# EAGLE design LCD 16x2 + PIN Button (EAGLE 9.5.2)
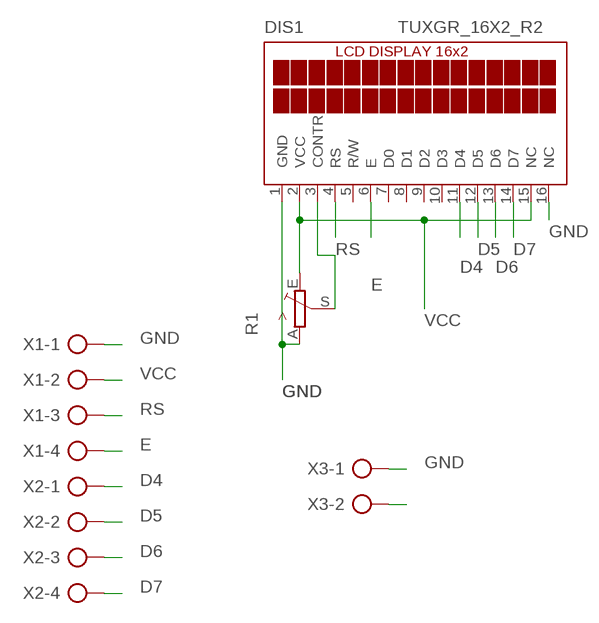
[diagram p0: schematic, sheet 1]

## Parts
DIS1  TUXGR_16X2_R2  [TUXGR_16X2_R2]
R1  TRIM_EU-B25P  [B25P]
X1  AK500/4-H  [AK500/4-H]
X2  AK500/4-H  [AK500/4-H]
X3  AK500/2-H  [AK500/2-H]

## Nets
D4: DIS1.11(D4) X2.1
D5: DIS1.12(D5) X2.2
D6: DIS1.13(D6) X2.3
D7: DIS1.14(D7) X2.4
E: DIS1.6(E) X1.4
GND: DIS1.1(GND) DIS1.16(NC) R1.A X1.1 X3.1
N$1: DIS1.3(CONTR) R1.S
N$3: X3.2
RS: DIS1.4(RS) X1.3
VCC: DIS1.2(VCC) DIS1.15(NC) R1.E X1.2
Unconnected: DIS1.5(R/W) DIS1.7(D0) DIS1.8(D1) DIS1.9(D2) DIS1.10(D3)

## Library data of the parts
DIS1 = display-lcd:TUXGR_16X2_R2: Tuxgraphics LCD display 16x2 characters reflective, without background light Source: tuxgr_12x2_r2.pdf; OC_FARNELL: unknown; OC_NEWARK: unknown
R1 = pot:TRIM_EU-: POTENTIOMETER
X1 X2 = con-ptr500:AK500/4-H: CONNECTOR Aug. 2004 / PTR Meßtechnik: Die Bezeichnung der Serie AK505 wurde geändert. Es handelt sich hierbei um AK500 in horizontaler Ausführung.; OC_FARNELL: unknown; OC_NEWARK: unknown
X3 = con-ptr500:AK500/2-H: CONNECTOR Aug. 2004 / PTR Meßtechnik: Die Bezeichnung der Serie AK505 wurde geändert. Es handelt sich hierbei um AK500 in horizontaler Ausführung.; OC_FARNELL: unknown; OC_NEWARK: unknown

## Board
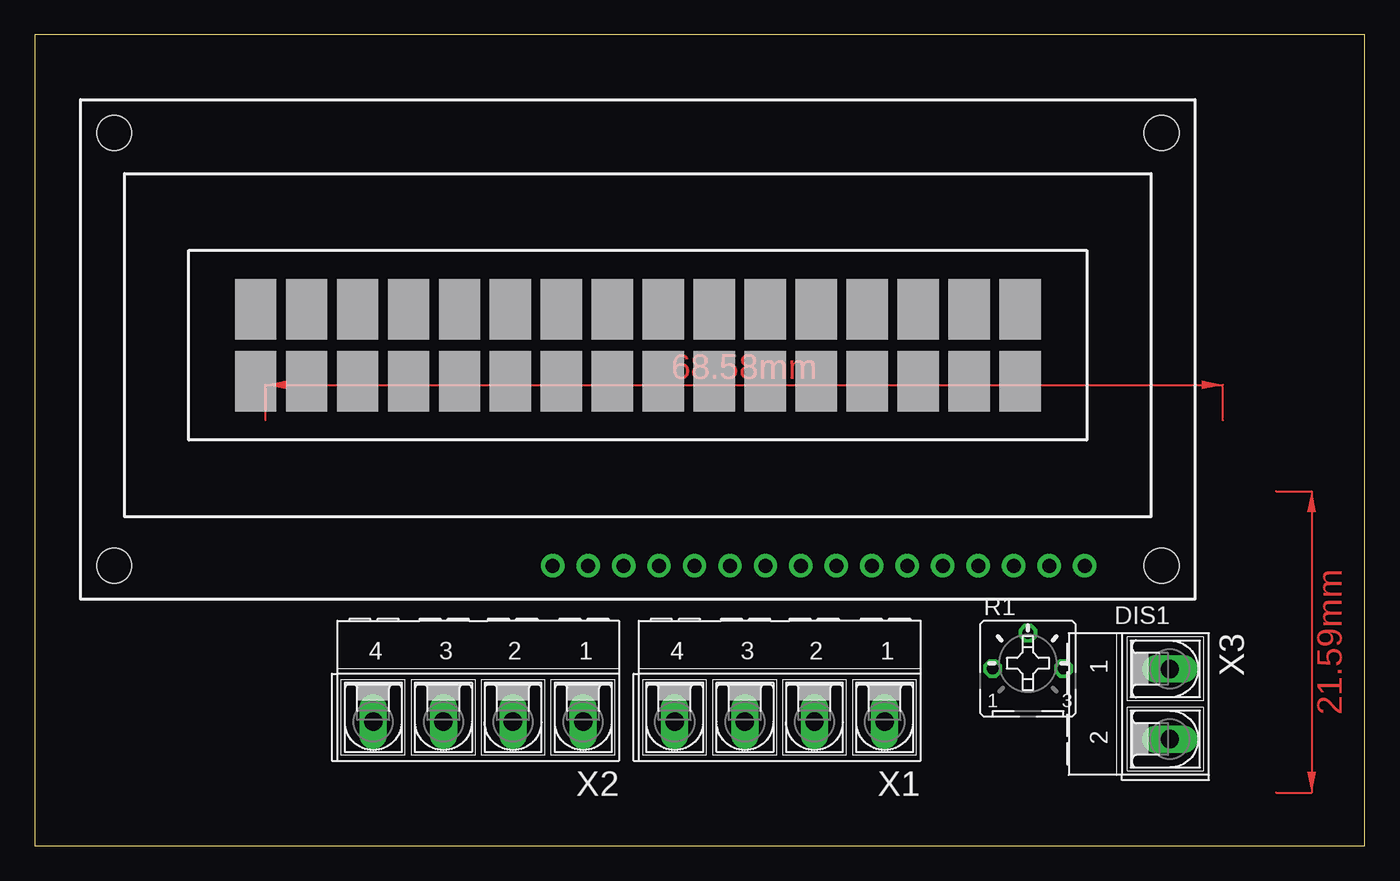
[diagram p1: board, top side]
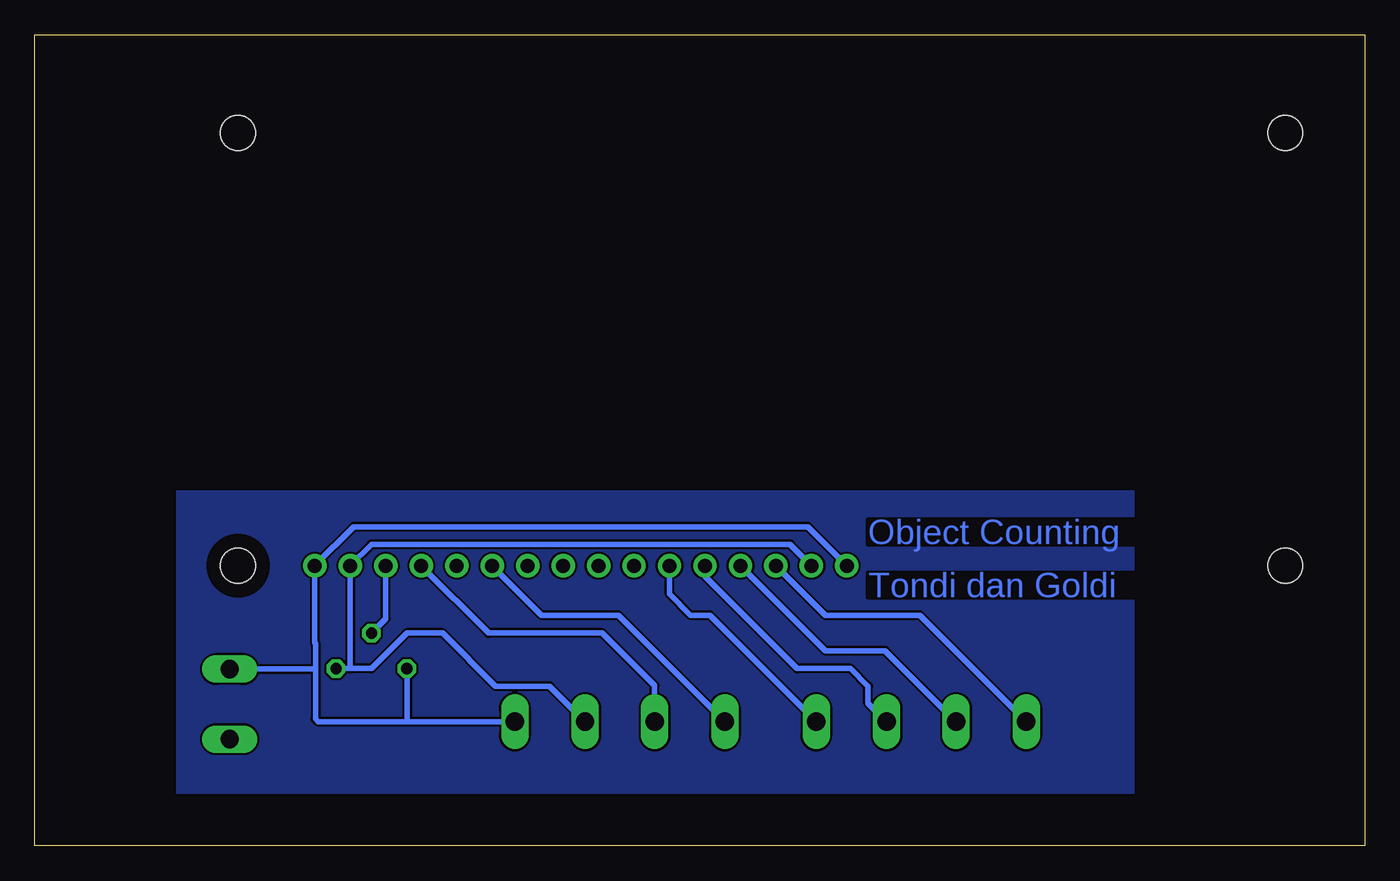
[diagram p2: board, bottom side, seen from below]

Size 95.23 x 58.09 mm. Coordinates in mm from the lower left corner, seen from the top.
Outline: 0,0 95.23,0 95.23,58.09 0,58.09 0,0
Copper layers (1*16): Top 0.035mm / dielectric 1.5mm / Bottom 0.035mm
Design rules "default": minimum track width 6mil, minimum drill 0.35mm, track to track 6mil, track to pad 6mil, pad to pad 6mil, via to via 6mil, smd to smd 6mil, copper to edge 40mil, drill to drill 6mil, minimum pad ring 10mil, minimum via ring 8mil, stop-mask expansion 4mil, vias tented up to drill 0mil, thermal gap 10mil

### Footprints (pad centres in the part's own frame; a part is rotated, then mirrored left to right if it is on the bottom)
TUXGR_16X2_R2 = drill 1 pad 1.676: 1 -32,15.5; 2 -29.46,15.5; 3 -26.92,15.5; 4 -24.38,15.5; 5 -21.84,15.5; 6 -19.3,15.5; 7 -16.76,15.5; 8 -14.22,15.5; 9 -11.68,15.5; 10 -9.14,15.5; 11 -6.6,15.5; 12 -4.06,15.5; 13 -1.52,15.5; 14 1.02,15.5; 15 3.56,15.5; 16 6.1,15.5 | hole 2.5: -37.5,-15.5; 37.5,-15.5; -37.5,15.5; 37.5,15.5
B25P = drill 0.813 octagon: A -2.54,0; E 2.54,0; S 0,2.54
AK500/4-H = drill 1.321 long: 1 -7.518,0; 2 -2.489,0; 3 2.489,0; 4 7.518,0
AK500/2-H = drill 1.321 long: 1 -2.515,0; 2 2.515,0

### Placement (x,y rotation side)
DIS1  43.18,35.56 180 top
R1  71.12,12.7 0 top
X1  53.34,8.89 180 top
X2  31.75,8.89 180 top
X3  81.28,10.16 270 top

### Tracks (layer width: path | path; a pad name or v marks a point on that pad's centre or on a via)
B1
  pour Bottom: 16.51,25.4 85.09,25.4 85.09,3.81 17.78,3.81 16.51,3.81
D4
  Bottom 0.406: X2.1 46.89,16.51 48.26,16.51 49.78,18.03 DIS1.11
D5
  Bottom 0.406: X2.2 35.56,10.21 35.56,11.43 36.83,12.7 40.64,12.7 47.24,19.3 DIS1.12
D6
  Bottom 0.406: X2.3 34.34,13.97 38.61,13.97 DIS1.13
D7
  Bottom 0.406: X2.4 31.85,16.51 38.61,16.51 DIS1.14
E
  Bottom 0.406: X1.4 53.44,16.51 58.93,16.51 DIS1.6
GND
  Bottom 0.406: DIS1.16 39.88,22.86 72.39,22.86 DIS1.1 75.18,14.55 75.13,14.5 75.13,12.7 | X1.1 68.58,8.89 | 68.58,8.89 74.93,8.89 75.13,9.09 75.13,12.7 | R1.A 68.58,8.89 | X3.1 75.16,12.68 75.13,12.7
N$1
  Bottom 0.406: R1.S 70.1,16.26 DIS1.3
RS
  Bottom 0.406: X1.3 50.85,11.48 54.61,15.24 62.74,15.24 DIS1.4
VCC
  Bottom 0.406: DIS1.15 41.15,21.59 71.12,21.59 DIS1.2 72.64,12.75 | X1.2 58.37,11.43 62.23,11.43 66.04,15.24 68.58,15.24 71.12,12.7 72.59,12.7 72.64,12.75 | 72.64,12.75 72.69,12.7 R1.E
(copper drawn outside any net)
  shapes: Top area x2

### Text on the board
Bottom: Object Counting | Tondi dan Goldi